# EAGLE design dms_sensor_board (EAGLE 6.4)
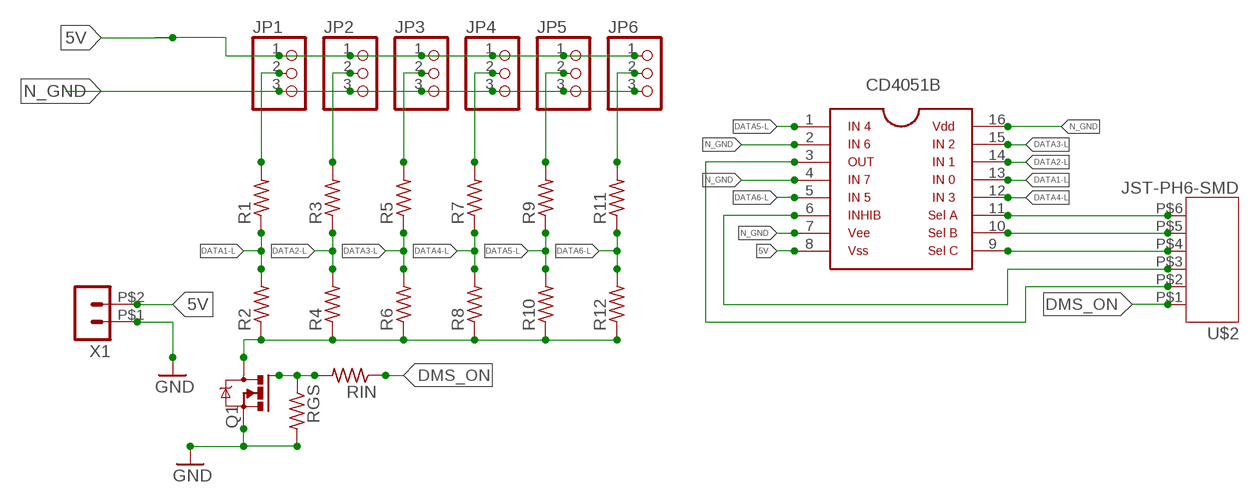
[diagram p0: schematic, sheet 1]

## Parts
JP1  PINHD-1X03_2.00  [1X03M]
JP2  PINHD-1X03_2.00  [1X03M]
JP3  PINHD-1X03_2.00  [1X03M]
JP4  PINHD-1X03_2.00  [1X03M]
JP5  PINHD-1X03_2.00  [1X03M]
JP6  PINHD-1X03_2.00  [1X03M]
MUX1  8X1  8X1_ANALOG_MUX  [SO16]
Q1  IRLML5203  [MICRO3]
R1  R-US_R0805  [R0805]
R2  R-US_R0805  [R0805]
R3  R-US_R0805  [R0805]
R4  R-US_R0805  [R0805]
R5  R-US_R0805  [R0805]
R6  R-US_R0805  [R0805]
R7  R-US_R0805  [R0805]
R8  R-US_R0805  [R0805]
R9  R-US_R0805  [R0805]
R10  R-US_R0805  [R0805]
R11  R-US_R0805  [R0805]
R12  R-US_R0805  [R0805]
RGS  R-US_R0805  [R0805]
RIN  R-US_R0805  [R0805]
U$2  JST-PH6-SMD  [JST-PH6-SMD]
X1  HEADER_POS2_43045-0206  [43045-0206]

## Nets
5V [power]: JP1.1 JP2.1 JP3.1 JP4.1 JP5.1 JP6.1 MUX1.8 X1.P$2
DATA1-H: JP1.2 R1.2
DATA1-L: MUX1.13 R1.1 R2.2
DATA2-H: JP2.2 R3.2
DATA2-L: MUX1.14 R3.1 R4.2
DATA3-H: JP3.2 R5.2
DATA3-L: MUX1.15 R5.1 R6.2
DATA4-H: JP4.2 R7.2
DATA4-L: MUX1.12 R7.1 R8.2
DATA5-H: JP5.2 R9.2
DATA5-L: MUX1.1 R9.1 R10.2
DATA6-H: JP6.2 R11.2
DATA6-L: MUX1.5 R11.1 R12.2
DMS_ON: RIN.1 U$2.P$1
GND [power]: Q1.3(S) RGS.2 X1.P$1
N$1: MUX1.11 U$2.P$6
N$2: MUX1.10 U$2.P$5
N$3: MUX1.9 U$2.P$4
N$4: MUX1.6 U$2.P$3
N$5: MUX1.3 U$2.P$2
N$8: Q1.1(G) RGS.1 RIN.2
N_GND [power]: JP1.3 JP2.3 JP3.3 JP4.3 JP5.3 JP6.3 MUX1.2 MUX1.4 MUX1.7 MUX1.16 Q1.2(D) R2.1 R4.1 R6.1 R8.1 R10.1 R12.1

## Library data of the parts
JP1-JP6 = pinhead-2:PINHD-1X03: PIN HEADER
MUX1 = ngohara_parts:8X1_ANALOG_MUX: CD4051B 8X1 analog mux http://www.ti.com/lit/ds/symlink/cd4051b.pdf
Q1 = ngohara_parts:IRLML5203: BSS138 N-Channel Power MOSFET
R1-R12 RGS RIN = resistor:R-US_: RESISTOR, American symbol
U$2 = jst-ph:JST-PH6-SMD: JST-PH6-SMD surface mounted 6 pin straight PH connector http://www.jst-mfg.com/product/pdf/eng/ePH.pdf
X1 = con-molex-micro-fit-3_0:HEADER_POS2_?: Molex - Micro-Fit 3.0 Series connector, 3.00mm (0.118") pitch header, 2 positions.

## Net classes
0 default: width 0.254 mm, drill 0.508 mm, clearance 0.254 mm
1 power: width 0.508 mm, drill 0.508 mm, clearance 0.508 mm

## Board
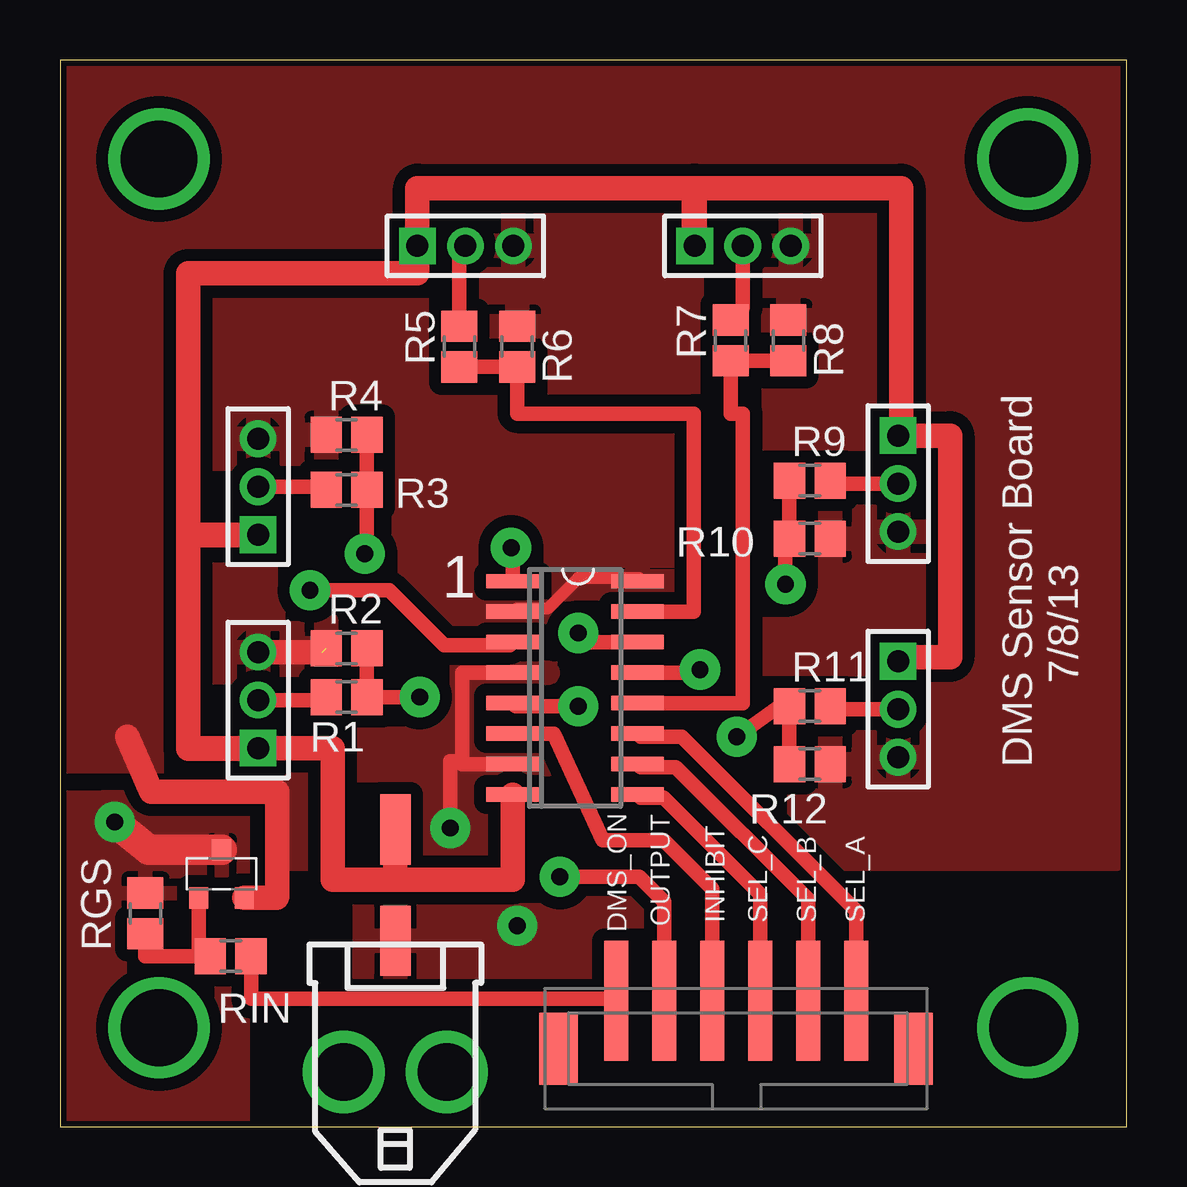
[diagram p1: board, top side]
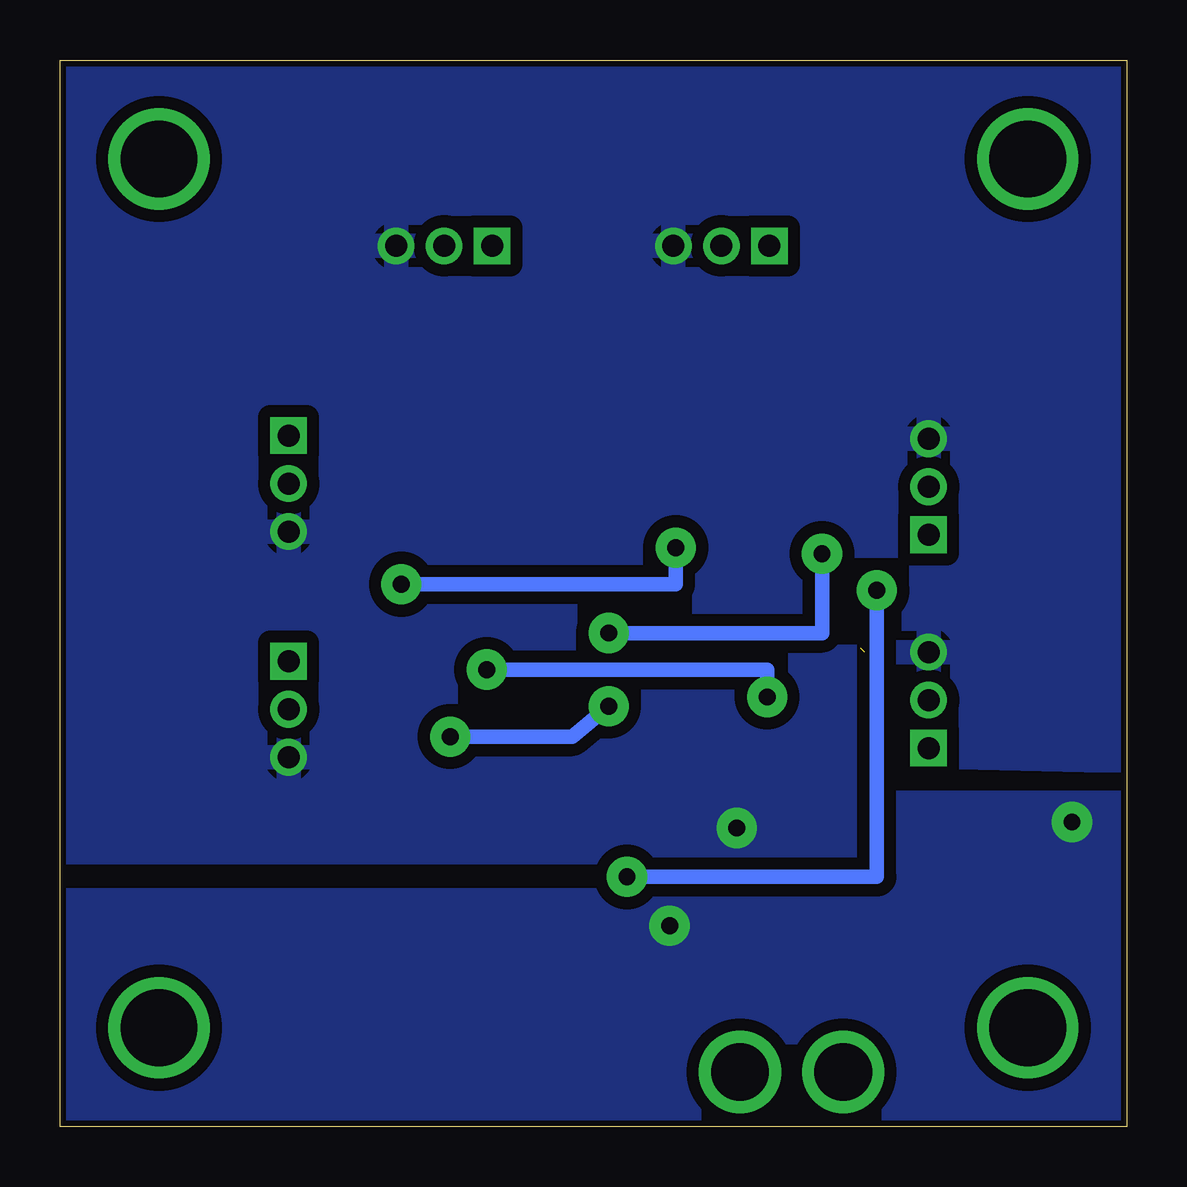
[diagram p2: board, bottom side, seen from below]

Size 44.45 x 44.45 mm. Coordinates in mm from the lower left corner, seen from the top.
Outline: 0,0 44.45,0 44.45,44.45 0,44.45 0,0
Copper layers (1*16): Top 0.035mm / dielectric 1.5mm / Bottom 0.035mm
Design rules "SparkFun": minimum track width 8mil, minimum drill 20mil, track to track 8mil, track to pad 8mil, pad to pad 8mil, via to via 8mil, smd to smd 8mil, copper to edge 10mil, drill to drill 8mil, minimum pad ring 12mil, minimum via ring 10mil, stop-mask expansion 4mil, vias tented up to drill 25mil, thermal gap 10mil

### Footprints (pad centres in the part's own frame; a part is rotated, then mirrored left to right if it is on the bottom)
1X03M = drill 0.914 square: 1 -2,0 | drill 0.914: 2 0,0; 3 2,0
SO16 = smd 0.6 x 2.2: 1 -4.445,-2.6; 2 -3.175,-2.6; 3 -1.905,-2.6; 4 -0.635,-2.6; 5 0.635,-2.6; 6 1.905,-2.6; 7 3.175,-2.6; 8 4.445,-2.6; 9 4.445,2.6; 10 3.175,2.6; 11 1.905,2.6; 12 0.635,2.6; 13 -0.635,2.6; 14 -1.905,2.6; 15 -3.175,2.6; 16 -4.445,2.6
MICRO3 = smd 0.8 x 0.9: 1 -0.95,-1; 2 0.95,-1; 3 0,1
R0805 = smd 1.3 x 1.5: 1 -0.85,0; 2 0.85,0
JST-PH6-SMD = smd 1 x 5: P$1 2.975,4.5; P$2 4.975,4.5; P$3 6.975,4.5; P$4 8.975,4.5; P$5 10.975,4.5; P$6 12.975,4.5 | smd 1.6 x 3: P$7 0.575,2.5; P$8 15.375,2.5
43045-0206 = smd 1.27 x 2.92: P$1 0,5.47; P$2 0,10.1 | drill 2.41: P$3 -2.15,0; P$4 2.15,0

### Placement (x,y rotation side)
JP1  8.26,17.78 90 top
JP2  8.26,26.67 90 top
JP3  16.89,36.7 0 top
JP4  28.45,36.7 0 top
JP5  34.92,26.8 270 top
JP6  34.92,17.4 270 top
MUX1  21.46,18.29 270 top
Q1  6.73,10.54 0 top
R1  11.94,17.91 180 top
R2  11.94,19.94 0 top
R3  11.94,26.54 180 top
R4  11.94,28.83 0 top
R5  16.64,32.51 90 top
R6  19.05,32.51 270 top
R7  27.94,32.77 90 top
R8  30.35,32.77 270 top
R9  31.24,26.92 0 top
R10  31.24,24.51 180 top
R11  31.24,17.53 0 top
R12  31.24,15.11 180 top
RGS  3.56,8.89 90 top
RIN  7.11,7.11 180 top
U$2  20.19,0.76 0 top
X1  13.97,2.29 0 top

### Tracks (layer width: path | path; a pad name or v marks a point on that pad's centre or on a via)
5V
  Top 1.016: 13.97,10.29 11.36,10.29 11.36,15.78 JP1.1 | 13.97,10.29 18.86,10.29 MUX1.8 | 5.33,15.75 8.26,15.75 JP1.1 | JP1.1 5.33,15.78 5.33,24.64 8.26,24.64 JP2.1 5.33,24.67 5.33,35.56 14.89,35.56 JP3.1 14.89,39.12 26.42,39.12 26.42,36.83 JP4.1 26.45,39.12 35.05,39.12 35.05,28.8 JP5.1 37.08,28.8 37.08,19.56 34.92,19.56 JP6.1 | X1.P$2 13.97,10.29
DATA1-H
  Top 0.61: JP1.2 11.09,17.78 R1.2
DATA1-L  (via drill 0.7 pad 1.68)
  Top 0.61: R2.2 R1.1 v14.99,17.91 | MUX1.13 26.67,18.92 v26.67,19.05
  Bottom 0.61: v26.67,19.05 14.99,19.05 v14.99,17.91
DATA2-H
  Top 0.61: JP2.2 11.09,26.67 R3.2
DATA2-L  (via drill 0.7 pad 1.68)
  Top 0.61: R4.2 R3.1 12.79,23.88 v12.7,23.88 | MUX1.14 21.59,20.19 v21.59,20.57
  Bottom 0.61: v21.59,20.57 12.7,20.57 v12.7,23.88
DATA3-H
  Top 0.61: JP3.2 16.64,36.7 R5.2
DATA3-L
  Top 0.61: R5.1 R6.2 19.05,29.72 26.42,29.72 26.42,21.46 MUX1.15
DATA4-H
  Top 0.61: JP4.2 28.45,34.12 R7.2
DATA4-L
  Top 0.61: R8.2 R7.1 27.94,29.72 28.45,29.72 28.45,17.65 MUX1.12
DATA5-H
  Top 0.61: JP5.2 32.22,26.8 R9.2
DATA5-L  (via drill 0.7 pad 1.68)
  Top 0.61: R9.1 R10.2 30.23,24.51 v30.23,22.61 | v18.8,24.13 18.86,24.13 MUX1.1
  Bottom 0.61: v30.23,22.61 18.8,22.61 v18.8,24.13
DATA6-H
  Top 0.61: JP6.2 32.22,17.4 R11.2
DATA6-L  (via drill 0.7 pad 1.68)
  Top 0.61: R12.2 R11.1 29.97,17.53 v28.19,16.26 | v21.59,17.53 18.99,17.53 MUX1.5
  Bottom 0.61: v28.19,16.26 23.11,16.26 v21.59,17.53
DMS_ON
  Top 0.61: U$2.P$1 23.17,5.33 7.96,5.33 RIN.1
GND  (via drill 0.7 pad 1.68)
  Top 1.27: Q1.3 3.7,11.54 v2.29,12.7
  other vias: 19.05,8.38
  pour Top: 12.7,0.76 24.13,0.76 24.13,9.4 12.7,9.4
  pour Bottom: -0.25,13.72 9.65,13.72 9.63,9.65 44.7,9.65 44.7,0 -0.25,0
  pour Top: 0.25,13.72 7.62,13.82 7.62,0 0.25,0
N$1
  Top 0.61: U$2.P$6 33.17,9 25.91,16.26 24.19,16.26 MUX1.11
N$2
  Top 0.61: U$2.P$5 31.17,9.47 25.65,14.99 24.19,14.99 MUX1.10
N$3
  Top 0.61: U$2.P$4 29.17,9.69 25.15,13.72 24.19,13.72 MUX1.9
N$4
  Top 0.61: U$2.P$3 27.17,9.92 25.15,11.94 22.61,11.94 20.57,16.38 MUX1.6
N$5  (via drill 0.7 pad 1.68)
  Top 0.61: U$2.P$2 25.17,9.38 24.13,10.41 v20.83,10.41 | v10.41,22.35 13.72,22.35 16,20.07 18.74,20.07 MUX1.3
  Bottom 0.61: v20.83,10.41 10.41,10.41 v10.41,22.35
N$6  (via drill 3.2)
  other vias: 4.13,40.32 40.32,40.32 4.13,4.13 40.32,4.13
N$8
  Top 0.61: RGS.1 3.56,7.11 RIN.2 5.78,7.11 Q1.1
N_GND  (via drill 0.7 pad 1.68)  (1 unrouted)
  Top 0.508: MUX1.2 19.05,21.59 20.32,21.59 21.59,22.86 24.13,22.86 MUX1.16
  Top 0.61: MUX1.4 16.76,18.92 16.76,15.24 | 16.76,15.24 16.26,15.24 v16.26,12.45 | MUX1.7 16.76,15.11 16.76,15.24
  Top 1.016: JP1.3 10.93,19.78 | Q1.2 9.03,9.54 9.04,9.65 9.04,13.97 3.81,13.97 2.79,16.26
  pour Top: 0.51,43.94 43.94,43.94 43.99,11.18 9.55,11.18 9.6,15.24 0,15.24
  pour Bottom: 0,15.24 11.43,15.49 11.43,11.43 44.7,11.43 44.96,44.7 -0.51,44.7

### Text on the board
tNames: 1 | DMS Sensor Board / 7/8/13 | INHIBIT | SEL_C | SEL_B | SEL_A | DMS_ON | OUTPUT